# EAGLE schematic DSP_DC_SYNTH (EAGLE 9.4.0)

## Sheet 1 of 3
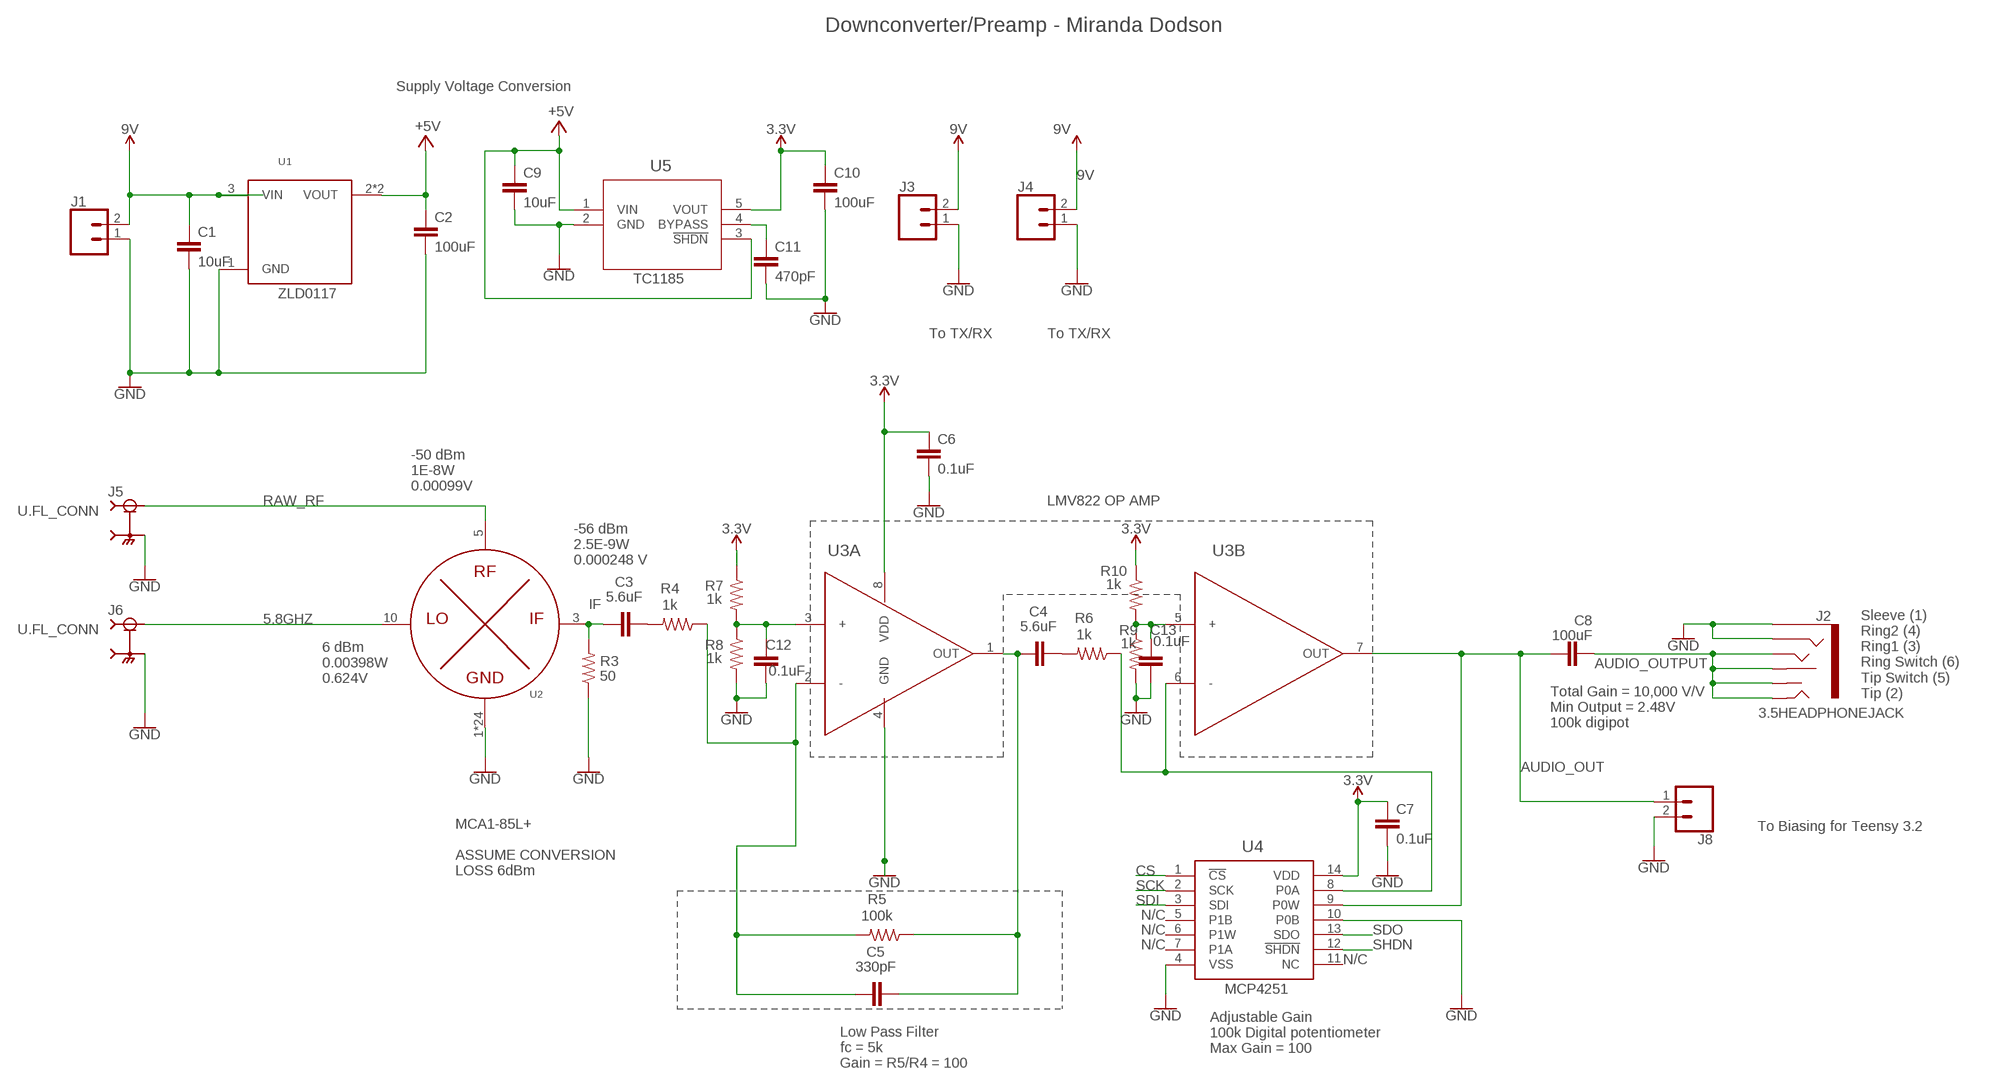
[diagram p0: schematic, sheet 1]

### Parts
C1  10uF  C0603  [R0603]
C2  100uF  C0603  [R0603]
C3  5.6uF  C0603  [R0603]
C4  5.6uF  C0603  [R0603]
C5  330pF  C0603  [R0603]
C6  0.1uF  C0603  [R0603]
C7  0.1uF  C0603  [R0603]
C8  100uF  EDK107M6R3A9GAA  [EXV-9G]
C9  10uF  C0603  [R0603]
C10  100uF  C0603  [R0603]
C11  470pF  C0603  [R0603]
C12  0.1uF  C0603  [R0603]
C13  0.1uF  C0603  [R0603]
J1  CONN_02  [1X02]
J2  3.5HEADPHONEJACK  [CONN6_SJ-43516-SMT]
J3  CONN_02  [1X02]
J4  CONN_02  [1X02]
J5  U.FL_CONN  [U.FL]
J6  U.FL_CONN  [U.FL]
J8  CONN_02  [1X02]
R3  50  R0603  [R0603]
R4  1k  R0603  [R0603]
R5  100k  R0603  [R0603]
R6  1k  R0603  [R0603]
R7  1k  R0603  [R0603]
R8  1k  R0603  [R0603]
R9  1k  R0603  [R0603]
R10  1k  R0603  [R0603]
U1  5V_REG  [5V_REG]
U2  MIXER  [MIXER]
U3  DUAL_OP_AMP_LMV822  [M08A]
U4  DIGITAL_POTDIGITAL_POT  [DIGITAL_POT]
U5  TC1185-3.3VCT713  [SOT-23-5_MC]

### Nets
3.3V: C6.1 C7.1 C10.1 R7.1 R10.1 U3.8(A:VDD) U4.14(VDD) U5.5(VOUT)
5.8GHZ: J6.1(SIG) U2.10(LO)
9V: C1.1 J1.2 J3.2 J4.2 U1.3(VIN)
+5V: C2.1 C9.1 U1.2(VOUT) U1.4(VOUT) U5.1(VIN) U5.3(!SHDN) ; also sheet 2
AUDIO_OUT: C8.1 J8.1 U3.7(B:OUT) U4.9(P0W) ; also sheet 2
AUDIO_OUTPUT: C8.2 J2.3(RINGSWITCH) J2.4(RING1) J2.7(TIPSWITCH) J2.8(TIP)
CS: U4.1(!CS)
GND: C1.2 C2.2 C6.2 C7.2 C9.2 C10.2 C11.2 C12.2 C13.2 J1.1 J2.1(SLEEVE) J2.2(RING2) J3.1 J4.1 J5.2(GND) J5.3(GND) J6.2(GND) J6.3(GND) J8.2 R3.1 R8.2 R9.2 U1.1(GND) U2.1(GND) U2.2(GND) U2.4(GND) U2.6(GND) U2.7(GND) U2.8(GND) U2.9(GND) U2.P$1(GND) U2.P$2(GND) U2.P$3(GND) U2.P$4(GND) U2.P$5(GND) U2.P$6(GND) U2.P$7(GND) U2.P$8(GND) U2.P$9(GND) U2.P$10(GND) U2.P$11(GND) U2.P$12(GND) U2.P$13(GND) U2.P$14(GND) U2.P$15(GND) U2.P$16(GND) U2.P$17(GND) U3.4(A:GND) U4.4(VSS) U4.10(P0B) U5.2(GND) ; also sheet 2,3
IF: C3.1 R3.2 U2.3(IF)
N$1: C4.1 C5.2 R5.1 U3.1(A:OUT)
N$3: C3.2 R4.2
N$4: C12.1 R7.2 R8.1 U3.3(A:+)
N$5: C11.1 U5.4(BYPASS)
N$7: C4.2 R6.2
N$8: C13.1 R9.1 R10.2 U3.5(B:+)
N$9: C5.1 R4.1 R5.2 U3.2(A:-)
N$13: R6.1 U3.6(B:-) U4.8(P0A)
RAW_RF: J5.1(SIG) U2.5(RF)
SCK: U4.2(SCK)
SDI: U4.3(SDI)
SDO: U4.13(SDO)
SHDN: U4.12(!SHDN)
Unconnected: U4.5(P1B) U4.6(P1W) U4.7(P1A) U4.11(NC)

### Notes on the sheet
- Downconverter/Preamp - Miranda Dodson
- Supply Voltage Conversion
- TC1185
- ZLD0117
- To TX/RX | To TX/RX
- -50 dBm
  1E-8W
  0.00099V
- LMV822 OP AMP
- -56 dBm
  2.5E-9W
  0.000248 V
- 6 dBm
  0.00398W
  0.624V
- Sleeve (1)
  Ring2 (4)
  Ring1 (3)
  Ring Switch (6)
  Tip Switch (5)
  Tip (2)
- Total Gain = 10,000 V/V
  Min Output = 2.48V
  100k digipot
- To Biasing for Teensy 3.2
- MCA1-85L+
  
  ASSUME CONVERSION
  LOSS 6dBm
- N/C
- N/C
- N/C
- N/C
- MCP4251
- Adjustable Gain
  100k Digital potentiometer
  Max Gain = 100
- Low Pass Filter
  fc = 5k
  Gain = R5/R4 = 100

## Sheet 2 of 3
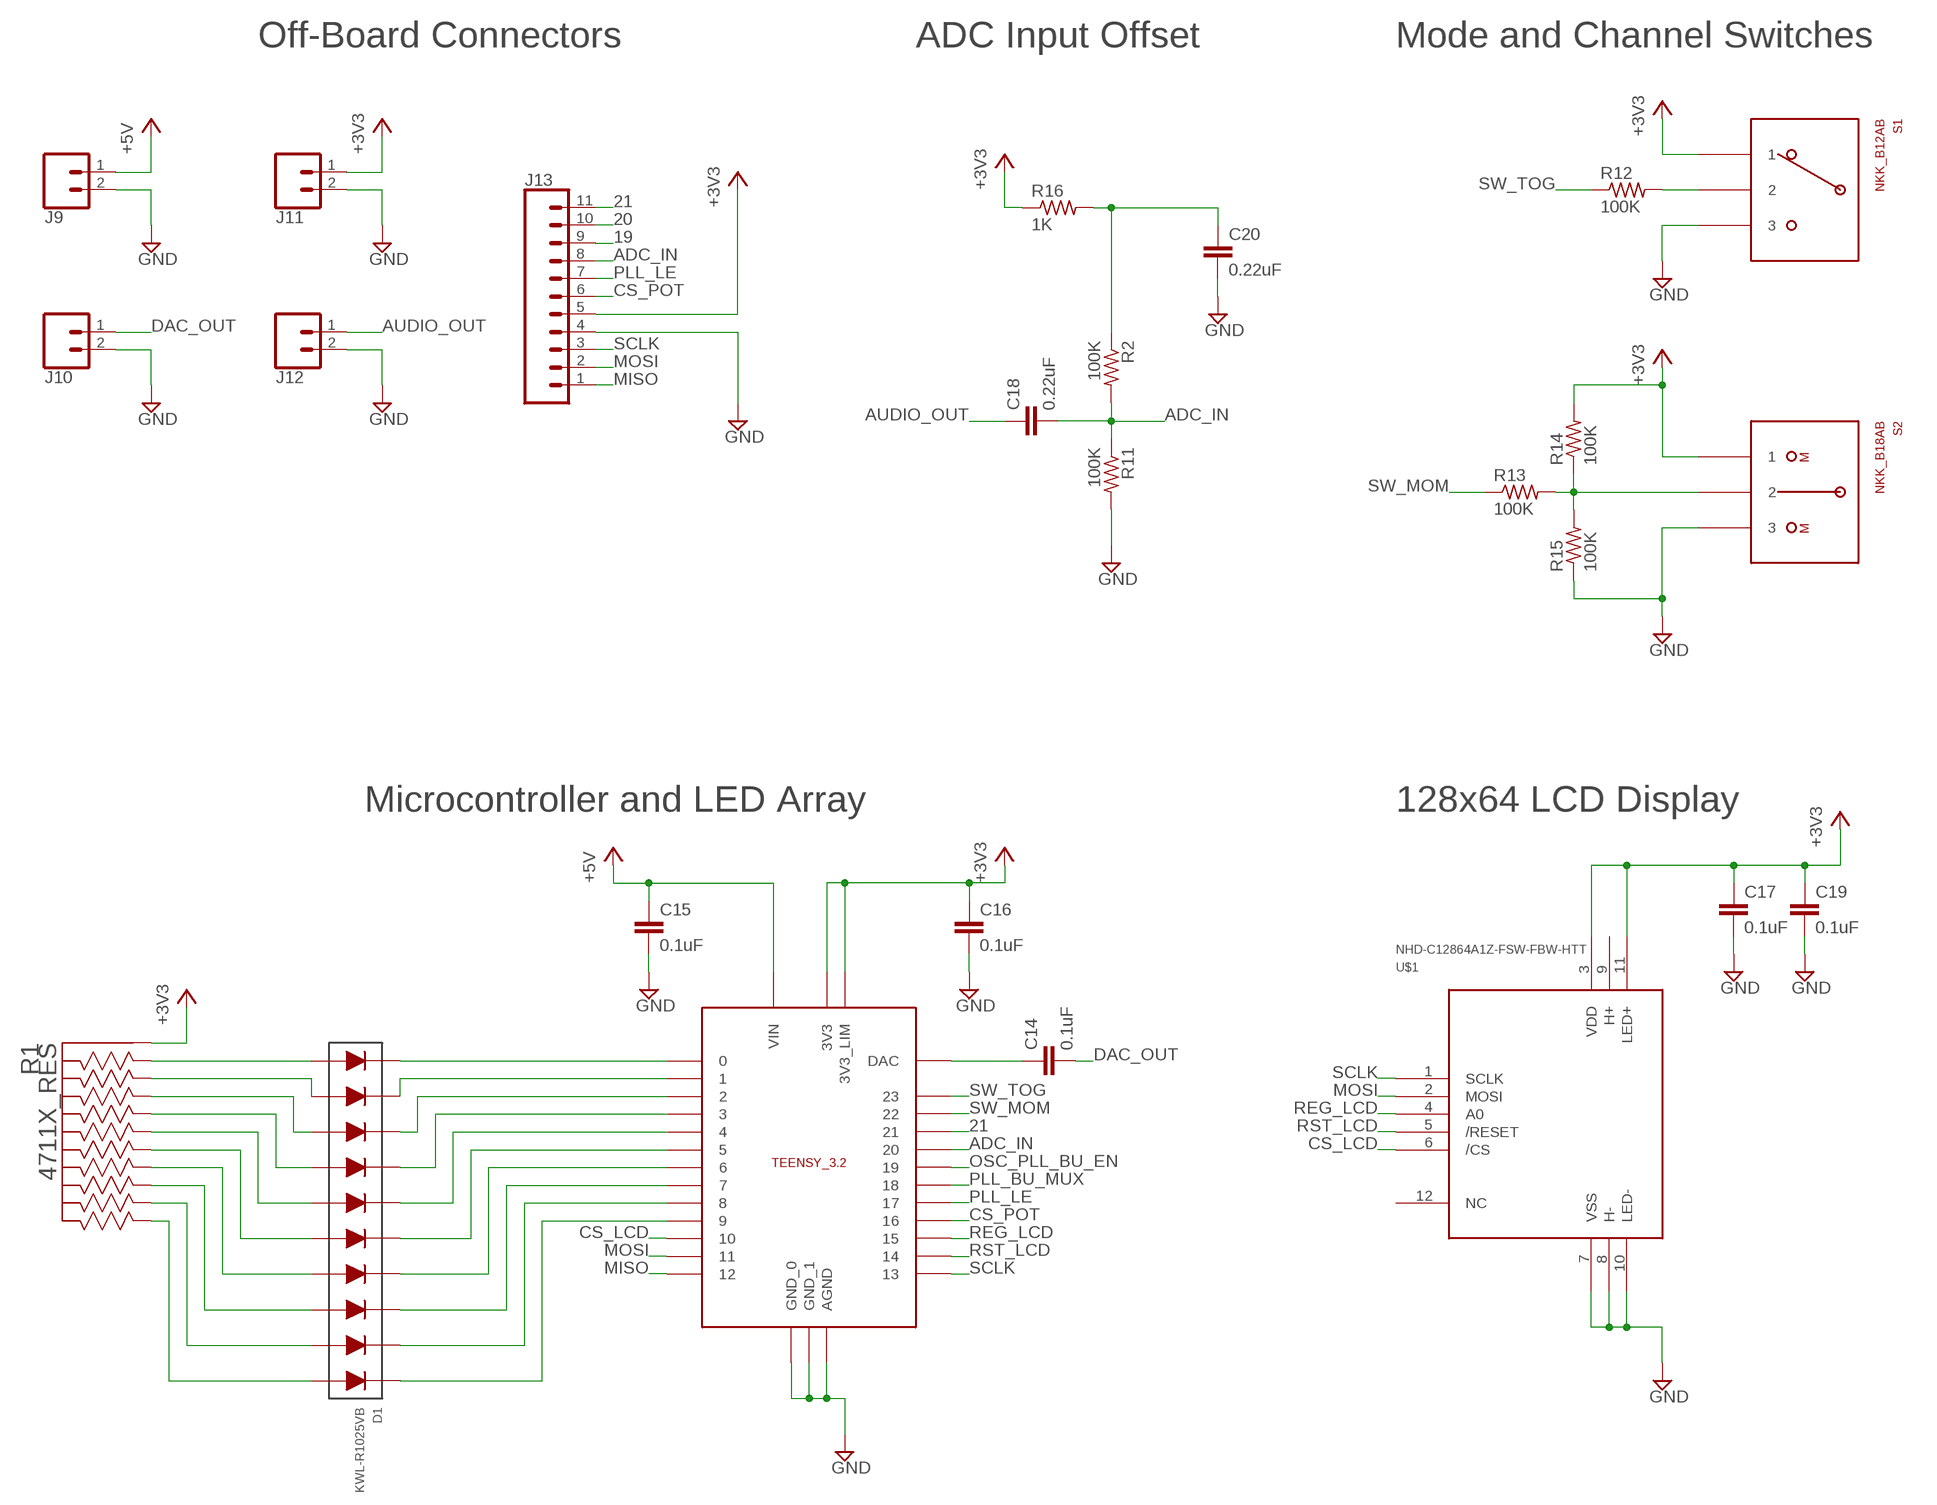
[diagram p1: schematic, sheet 2]

### Parts
C14  0.1uF  C0603  [0603]
C15  0.1uF  C0603  [0603]
C16  0.1uF  C0603  [0603]
C17  0.1uF  C0603  [0603]
C18  0.22uF  C0603  [0603]
C19  0.1uF  C0603  [0603]
C20  0.22uF  C0603  [0603]
D1  KWL-R1025VB  [KWL-R1025VB]
J9  CONN_02  [1X02]
J10  CONN_02  [1X02]
J11  CONN_02  [1X02]
J12  CONN_02  [1X02]
J13  CONN_11  [1X11]
R1  4711X_RES  [BO_4611X]
R2  100K  R0603  [0603]
R11  100K  R0603  [0603]
R12  100K  R0603  [0603]
R13  100K  R0603  [0603]
R14  100K  R0603  [0603]
R15  100K  R0603  [0603]
R16  1K  R0603  [0603]
S1  NKK_B12AB  [NKK_SPDT_BRKT]
S2  NKK_B18AB  [NKK_SPDT_BRKT]
TEENSY_3.2  TEENSY_3.2_SOCKET  [TEENSY_3.2_SOCKET]
U$1  NHD-C12864A1Z-FSW-FBW-HTT  [NHD-C12864A1Z-FSW-FBW-HTT]

### Nets
19: J13.9
20: J13.10
21: J13.11 TEENSY_3.2.21
+3V3: C16.1 C17.1 C19.1 J11.1 J13.5 R1.1 R14.2 R16.1 S1.3 S2.3 TEENSY_3.2.3V3 TEENSY_3.2.3V3_LIM U$1.3(VDD) U$1.11(LED+) ; also sheet 3
+5V: C15.1 J9.1 TEENSY_3.2.VIN ; also sheet 1
ADC_IN: C18.2 J13.8 R2.2 R11.1 TEENSY_3.2.20
AUDIO_OUT: C18.1 J12.1 ; also sheet 1
CS_LCD: TEENSY_3.2.10 U$1.6(/CS)
CS_POT: J13.6 TEENSY_3.2.16
DAC_OUT: C14.2 J10.1
GND: C15.2 C16.2 C17.2 C19.2 C20.2 J9.2 J10.2 J11.2 J12.2 J13.4 R11.2 R15.1 S1.5 S2.5 TEENSY_3.2.AGND TEENSY_3.2.GND_0 TEENSY_3.2.GND_1 U$1.7(VSS) U$1.8(H-) U$1.10(LED-) ; also sheet 1,3
MISO: J13.1 TEENSY_3.2.12
MOSI: J13.2 TEENSY_3.2.11 U$1.2(MOSI) ; also sheet 3
N$2: C14.1 TEENSY_3.2.DAC
N$6: D1.1+ R1.2
N$10: D1.2+ R1.3
N$11: D1.3+ R1.4
N$12: D1.4+ R1.5
N$14: D1.5+ R1.6
N$15: D1.6+ R1.7
N$16: D1.7+ R1.8
N$17: D1.8+ R1.9
N$18: D1.9+ R1.10
N$19: D1.10+ R1.11
N$20: D1.1- TEENSY_3.2.0
N$21: D1.2- TEENSY_3.2.1
N$22: D1.3- TEENSY_3.2.2
N$23: D1.4- TEENSY_3.2.3
N$24: D1.5- TEENSY_3.2.4
N$25: D1.6- TEENSY_3.2.5
N$26: D1.7- TEENSY_3.2.6
N$27: D1.8- TEENSY_3.2.7
N$28: D1.9- TEENSY_3.2.8
N$29: D1.10- TEENSY_3.2.9
N$30: R13.2 R14.1 R15.2 S2.4
N$31: R12.2 S1.4
N$32: C20.1 R2.1 R16.2
OSC_PLL_BU_EN: TEENSY_3.2.19 ; also sheet 3
PLL_BU_MUX: TEENSY_3.2.18 ; also sheet 3
PLL_LE: J13.7 TEENSY_3.2.17 ; also sheet 3
REG_LCD: TEENSY_3.2.15 U$1.4(A0)
RST_LCD: TEENSY_3.2.14 U$1.5(/RESET)
SCLK: J13.3 TEENSY_3.2.13 U$1.1(SCLK) ; also sheet 3
SW_MOM: R13.1 TEENSY_3.2.22
SW_TOG: R12.1 TEENSY_3.2.23
Unconnected: U$1.9(H+) U$1.12(NC)

### Notes on the sheet
- Off-Board Connectors | ADC Input Offset | Mode and Channel Switches
- Microcontroller and LED Array | 128x64 LCD Display

## Sheet 3 of 3
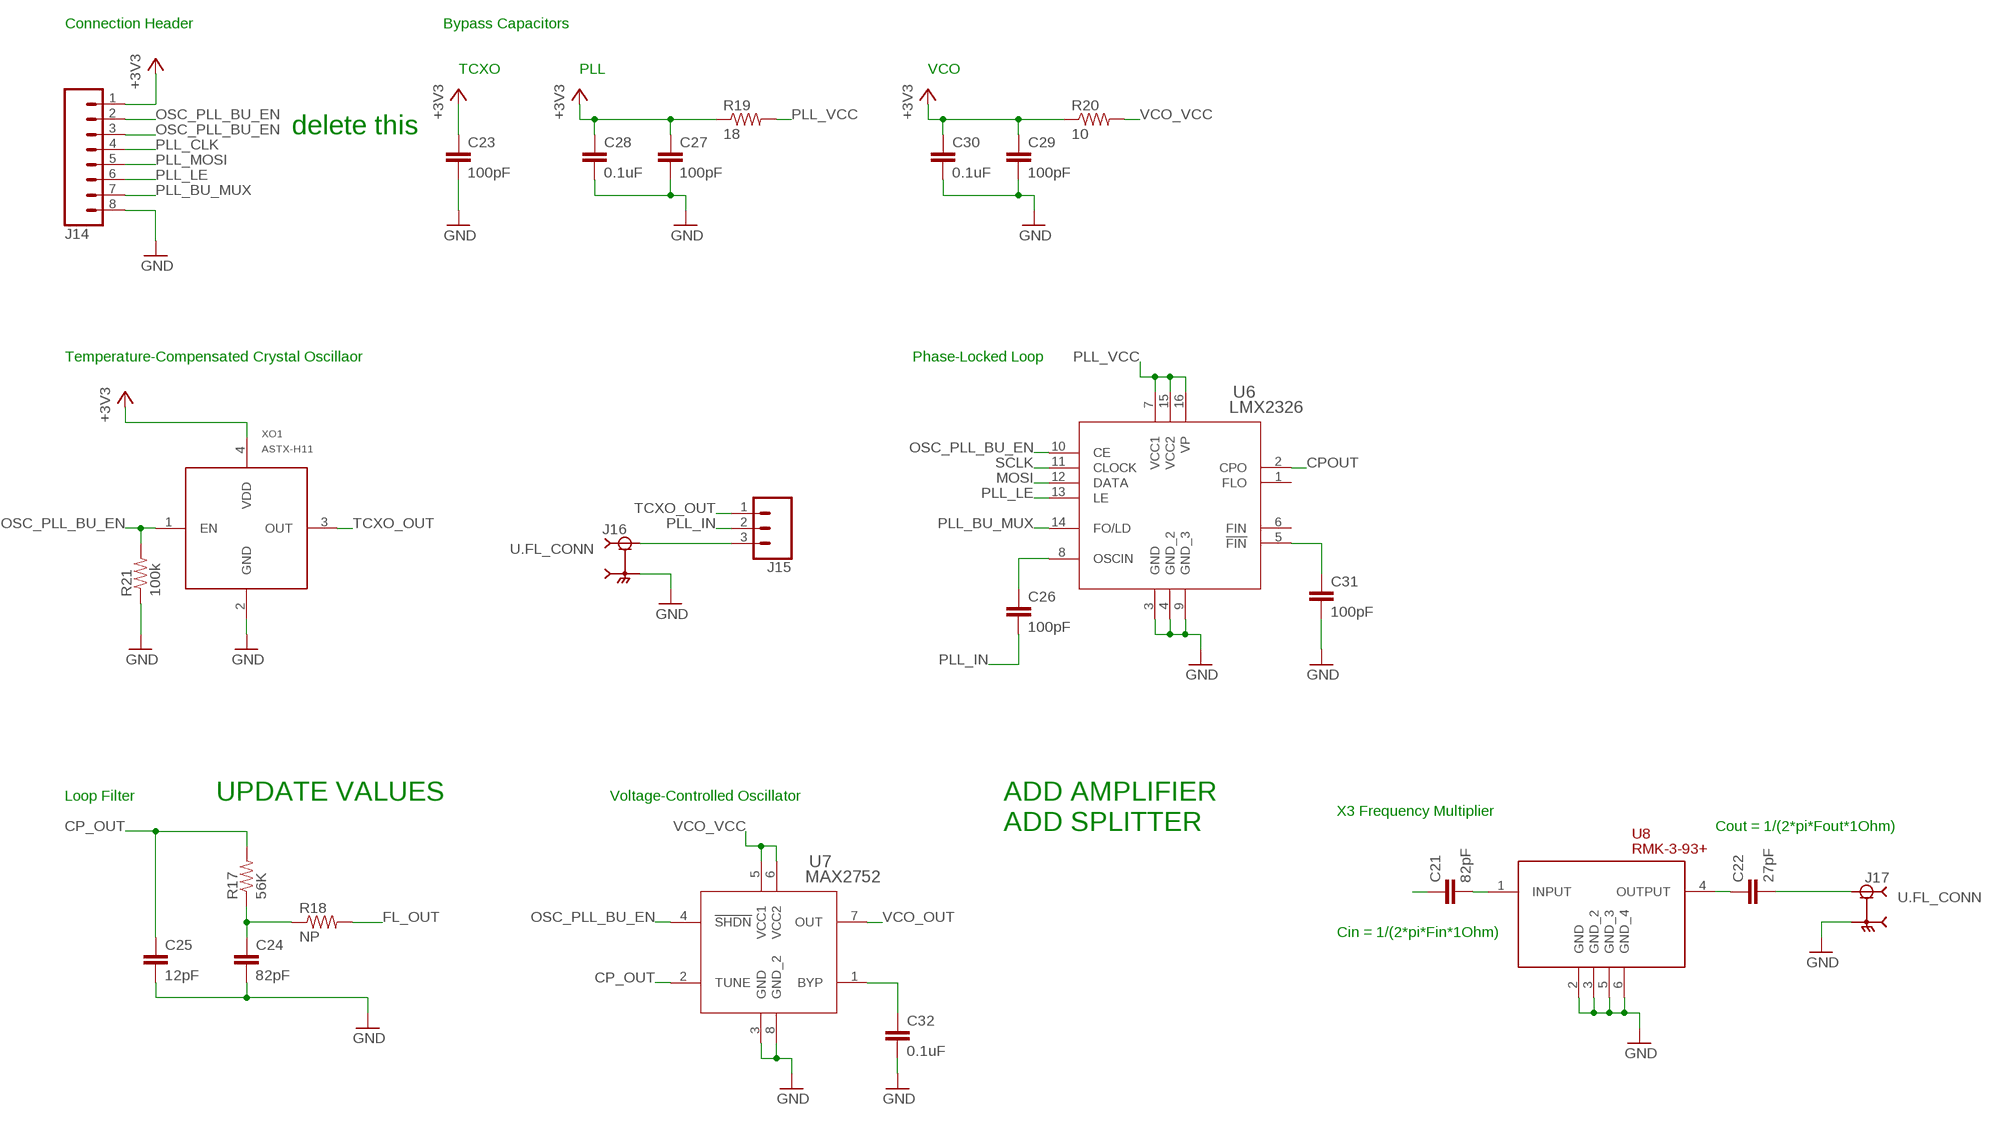
[diagram p2: schematic, sheet 3]

### Parts
C21  82pF  C0603  [0603]
C22  27pF  C0603  [0603]
C23  100pF  C0603  [0603]
C24  82pF  C0603  [0603]
C25  12pF  C0603  [0603]
C26  100pF  C0603  [0603]
C27  100pF  C0603  [0603]
C28  0.1uF  C0603  [0603]
C29  100pF  C0603  [0603]
C30  0.1uF  C0603  [0603]
C31  100pF  C0603  [0603]
C32  0.1uF  C0603  [0603]
J14  CONN_08"  [1X08]
J15  CONN_03  [1X03]
J16  U.FL_CONN  [U.FL]
J17  U.FL_CONN  [U.FL]
R17  56K  R0603  [0603]
R18  NP  R0603  [0603]
R19  18  R0603  [0603]
R20  10  R0603  [0603]
R21  100k  R0603  [0603]
U6  LMX2326  [MTC16]
U7  MAX2752  [21-0036K]
U8  RMK-3-93+  [TT1224]
XO1  ASTX-H11  [ASTX-H11]

### Nets
+3V3: C23.1 C27.1 C28.1 C29.1 C30.1 J14.1 R19.1 R20.1 XO1.4(VDD) ; also sheet 2
CP_OUT: C25.1 R17.2 U7.2(TUNE)
CPOUT: U6.2(CPO)
FL_OUT: R18.2
GND: C23.2 C24.2 C25.2 C27.2 C28.2 C29.2 C30.2 C31.2 C32.2 J14.8 J16.2(GND) J16.3(GND) J17.2(GND) J17.3(GND) R21.1 U6.3(GND) U6.4(GND_2) U6.9(GND_3) U7.3(GND) U7.8(GND_2) U8.2(GND) U8.3(GND_2) U8.5(GND_3) U8.6(GND_4) XO1.2(GND) ; also sheet 1,2
MOSI: U6.12(DATA) ; also sheet 2
N$33: C21.2 U8.1(INPUT)
N$34: C22.1 U8.4(OUTPUT)
N$35: C26.1 U6.8(OSCIN)
N$36: C24.1 R17.1 R18.1
N$37: C31.1 U6.5(!FIN)
N$38: C32.1 U7.1(BYP)
N$39: J15.3 J16.1(SIG)
N$40: C22.2 J17.1(SIG)
OSC_PLL_BU_EN: J14.2 R21.2 U6.10(CE) U7.4(!SHDN) XO1.1(EN) ; also sheet 2
PLL_BU_MUX: J14.7 U6.14(FO/LD) ; also sheet 2
PLL_IN: C26.2 J15.2
PLL_LE: U6.13(LE) ; also sheet 2
PLL_VCC: R19.2 U6.7(VCC1) U6.15(VCC2) U6.16(VP)
SCLK: U6.11(CLOCK) ; also sheet 2
TCXO_OUT: J15.1 XO1.3(OUT)
VCO_OUT: C21.1 U7.7(OUT)
VCO_VCC: R20.2 U7.5(VCC1) U7.6(VCC2)
Unconnected: J14.3 J14.4 J14.5 J14.6 U6.1(FLO) U6.6(FIN)

### Notes on the sheet
- Connection Header | Bypass Capacitors
- TCXO | PLL | VCO
- delete this
- Temperature-Compensated Crystal Oscillaor | Phase-Locked Loop
- Loop Filter | UPDATE VALUES | Voltage-Controlled Oscillator | ADD AMPLIFIER
- X3 Frequency Multiplier
- ADD SPLITTER | Cout = 1/(2*pi*Fout*1Ohm)
- Cin = 1/(2*pi*Fin*1Ohm)

## Library data of the parts
C1-C7 C9-C13 = 764Library:C0603
C8 = 764Library:EDK107M6R3A9GAA; MANUFACTURER_PART_NUMBER: EDK107M6R3A9GAA; VENDOR: KEMET
C14-C32 = kiss_z:C0603
D1 = kiss_z:KWL-R1025VB
J1 J3 J4 J8-J12 = SparkFun-Connectors:CONN_02: Multi connection point. Often used as Generic Header-pin footprint for 0.1 inch spaced/style header connections On any of the 0.1 inch spaced packages, you can populate with these: Break Away Headers - Straight <https://www.sparkfun.com/products/116> (PRT-00116) Break Away Male Headers - Right Angle <https://www.sparkfun.com/products/553> (PRT-00553) Female Headers <https://www.sparkfun.com/products/115> (PRT-00115) Break Away Headers - Machine Pin <https://www.sparkfun.com/products/117> (PRT-00117) Break Away Female Headers - Swiss Machine Pin <https://www.sparkfun.com/products/743> (PRT-00743) For SCREWTERMINALS and SPRING TERMINALS visit here: Screw Terimnals on SparkFun.com <https://www.sparkfun.com/search/results?term=Screw+Terminals> (5mm/3.5mm/2.54mm spacing) This device is also useful as a general connection point to wire up your design to another part of your project. Our various solder wires solder well into these plated through hole pads. Hook-Up Wire - Assortment (Stranded, 22 AWG) <https://www.sparkfun.com/products/11375> (PRT-11375) Hook-Up Wire - Assortment (Solid Core, 22 AWG) <https://www.sparkfun.com/products/11367> (PRT-11367) View the entire wire category on our website here <https://www.sparkfun.com/categories/141> Special notes: Molex polarized connector foot print use with: PRT-08233 with associated crimp pins and housings. 2.54_SCREWTERM for use with PRT-10571. 3.5mm Screw Terminal footprints for PRT-08084 5mm Screw Terminal footprints for use with PRT-08432
J2 = 764Library:3.5HEADPHONEJACK
J5 J6 J16 J17 = 764Library:U.FL_CONN: U.FL Series 50 Ohm Receptacle Male Pins Ultra Small SMT Coaxial Connector; AVAILABILITY: Unavailable; DESCRIPTION: U.FL Series 50 Ohm Receptacle Male Pins Ultra Small SMT Coaxial Connector; MF: Hirose; MP: U.FL-R-SMT_10_; PACKAGE: FakePackage u; PRICE: None
J13 = SparkFun-Connectors:CONN_11: Multi connection point. Often used as Generic Header-pin footprint for 0.1 inch spaced/style header connections On any of the 0.1 inch spaced packages, you can populate with these: Break Away Headers - Straight <https://www.sparkfun.com/products/116> (PRT-00116) Break Away Male Headers - Right Angle <https://www.sparkfun.com/products/553> (PRT-00553) Female Headers <https://www.sparkfun.com/products/115> (PRT-00115) Break Away Headers - Machine Pin <https://www.sparkfun.com/products/117> (PRT-00117) Break Away Female Headers - Swiss Machine Pin <https://www.sparkfun.com/products/743> (PRT-00743) For SCREWTERMINALS and SPRING TERMINALS visit here: Screw Terimnals on SparkFun.com <https://www.sparkfun.com/search/results?term=Screw+Terminals> (5mm/3.5mm/2.54mm spacing) This device is also useful as a general connection point to wire up your design to another part of your project. Our various solder wires solder well into these plated through hole pads. Hook-Up Wire - Assortment (Stranded, 22 AWG) <https://www.sparkfun.com/products/11375> (PRT-11375) Hook-Up Wire - Assortment (Solid Core, 22 AWG) <https://www.sparkfun.com/products/11367> (PRT-11367) View the entire wire category on our website here <https://www.sparkfun.com/categories/141>
J14 = SparkFun-Connectors:CONN_08: Multi connection point. Often used as Generic Header-pin footprint for 0.1 inch spaced/style header connections On any of the 0.1 inch spaced packages, you can populate with these: Break Away Headers - Straight <https://www.sparkfun.com/products/116> (PRT-00116) Break Away Male Headers - Right Angle <https://www.sparkfun.com/products/553> (PRT-00553) Female Headers <https://www.sparkfun.com/products/115> (PRT-00115) Break Away Headers - Machine Pin <https://www.sparkfun.com/products/117> (PRT-00117) Break Away Female Headers - Swiss Machine Pin <https://www.sparkfun.com/products/743> (PRT-00743) Arduino Stackable Header - 8 Pin <https://www.sparkfun.com/products/9279> (PRT-09279) For SCREWTERMINALS and SPRING TERMINALS visit here: Screw Terimnals on SparkFun.com <https://www.sparkfun.com/search/results?term=Screw+Terminals> (5mm/3.5mm/2.54mm spacing) This device is also useful as a general connection point to wire up your design to another part of your project. Our various solder wires solder well into these plated through hole pads. Hook-Up Wire - Assortment (Stranded, 22 AWG) <https://www.sparkfun.com/products/11375> (PRT-11375) Hook-Up Wire - Assortment (Solid Core, 22 AWG) <https://www.sparkfun.com/products/11367> (PRT-11367) View the entire wire category on our website here <https://www.sparkfun.com/categories/141> Special notes: Molex polarized connector foot print use with SKU : PRT-08231 with associated crimp pins and housings. 1MM SMD Version SKU: PRT-10208 NOTES ON THE VARIANTS LOCK and LOCK_LONGPADS... This footprint was designed to help hold the alignment of a through-hole component (i.e. 6-pin header) while soldering it into place. You may notice that each hole has been shifted either up or down by 0.005 of an inch from it's more standard position (which is a perfectly straight line). This slight alteration caused the pins (the squares in the middle) to touch the edges of the holes. Because they are alternating, it causes a "brace" to hold the component in place. 0.005 has proven to be the perfect amount of "off-center" position when using our standard breakaway headers. Although looks a little odd when you look at the bare footprint, once you have a header in there, the alteration is very hard to notice. Also,if you push a header all the way into place, it is covered up entirely on the bottom side.; PROD_ID: CONN-08438
J15 = SparkFun-Connectors:CONN_03: Multi connection point. Often used as Generic Header-pin footprint for 0.1 inch spaced/style header connections On any of the 0.1 inch spaced packages, you can populate with these: Break Away Headers - Straight <https://www.sparkfun.com/products/116> (PRT-00116) Break Away Male Headers - Right Angle <https://www.sparkfun.com/products/553> (PRT-00553) Female Headers <https://www.sparkfun.com/products/115> (PRT-00115) Break Away Headers - Machine Pin <https://www.sparkfun.com/products/117> (PRT-00117) Break Away Female Headers - Swiss Machine Pin <https://www.sparkfun.com/products/743> (PRT-00743) Stackable Header - 3 Pin (Female, 0.1") <https://www.sparkfun.com/products/13875> (PRT-13875) For SCREWTERMINALS and SPRING TERMINALS visit here: Screw Terimnals on SparkFun.com <https://www.sparkfun.com/search/results?term=Screw+Terminals> (5mm/3.5mm/2.54mm spacing) This device is also useful as a general connection point to wire up your design to another part of your project. Our various solder wires solder well into these plated through hole pads. Hook-Up Wire - Assortment (Stranded, 22 AWG) <https://www.sparkfun.com/products/11375> (PRT-11375) Hook-Up Wire - Assortment (Solid Core, 22 AWG) <https://www.sparkfun.com/products/11367> (PRT-11367) View the entire wire category on our website here <https://www.sparkfun.com/categories/141> Special notes: Molex polarized connector foot print use with SKU : PRT-08232 with associated crimp pins and housings.
R1 = kiss_z:4711X_RES
R2 R11-R21 = kiss_z:R0603
R3-R10 = 764Library:R0603
S1 = kiss_z:NKK_B12AB
S2 = kiss_z:NKK_B18AB
TEENSY_3.2 = kiss_z:TEENSY_3.2_SOCKET
U1 = 764Library:5V_REG
U2 = 764Library:MIXER
U3 = 764Library:DUAL_OP_AMP_LMV822
U4 = 764Library:DIGITAL_POT
U5 = 764Library:TC1185-3.3VCT713; MANUFACTURER_PART_NUMBER: TC11853.3VCT713; VENDOR: Microchip
U6 = kiss_z:LMX2326
U7 = kiss_z:MAX2752
U8 = kiss_z:RMK-3-93+
U$1 = kiss_z:NHD-C12864A1Z-FSW-FBW-HTT
XO1 = kiss_z:ASTX-H11